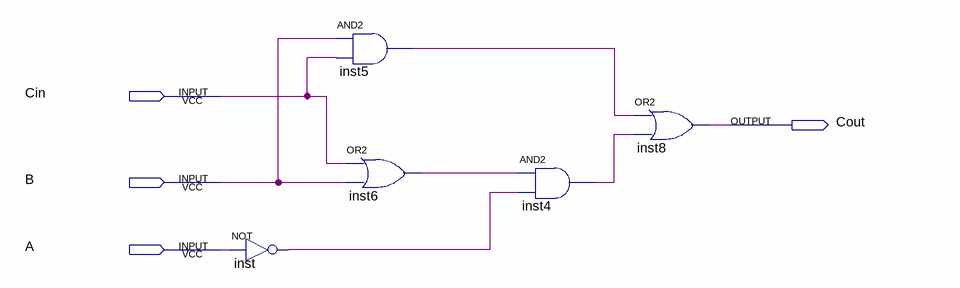
[diagram p0: schematic sheet]
// Quartus schematic MENOR1-DIAGRAMA.bdf as structural Verilog: 5 symbols, 4 pins
module \MENOR1-DIAGRAMA  (
  input  Cin,
  input  B,
  input  A,
  output Cout
);

  wire inst4_out, inst5_out, inst6_out, inst_out;

  not inst (inst_out, A);
  and inst5 (inst5_out, B, Cin);
  or inst6 (inst6_out, Cin, B);
  and inst4 (inst4_out, inst6_out, inst_out);
  or inst8 (Cout, inst5_out, inst4_out);
endmodule
